# Altium schematic sheet power.SchDoc: Power
size A4; Organization: Altium Limited; Address1: L3, 12a Rodborough Rd; Address2: Frenchs Forest; Address3: NSW; Address4: Australia 2086; Revision: A; SheetNumber: 7; SheetTotal: 7
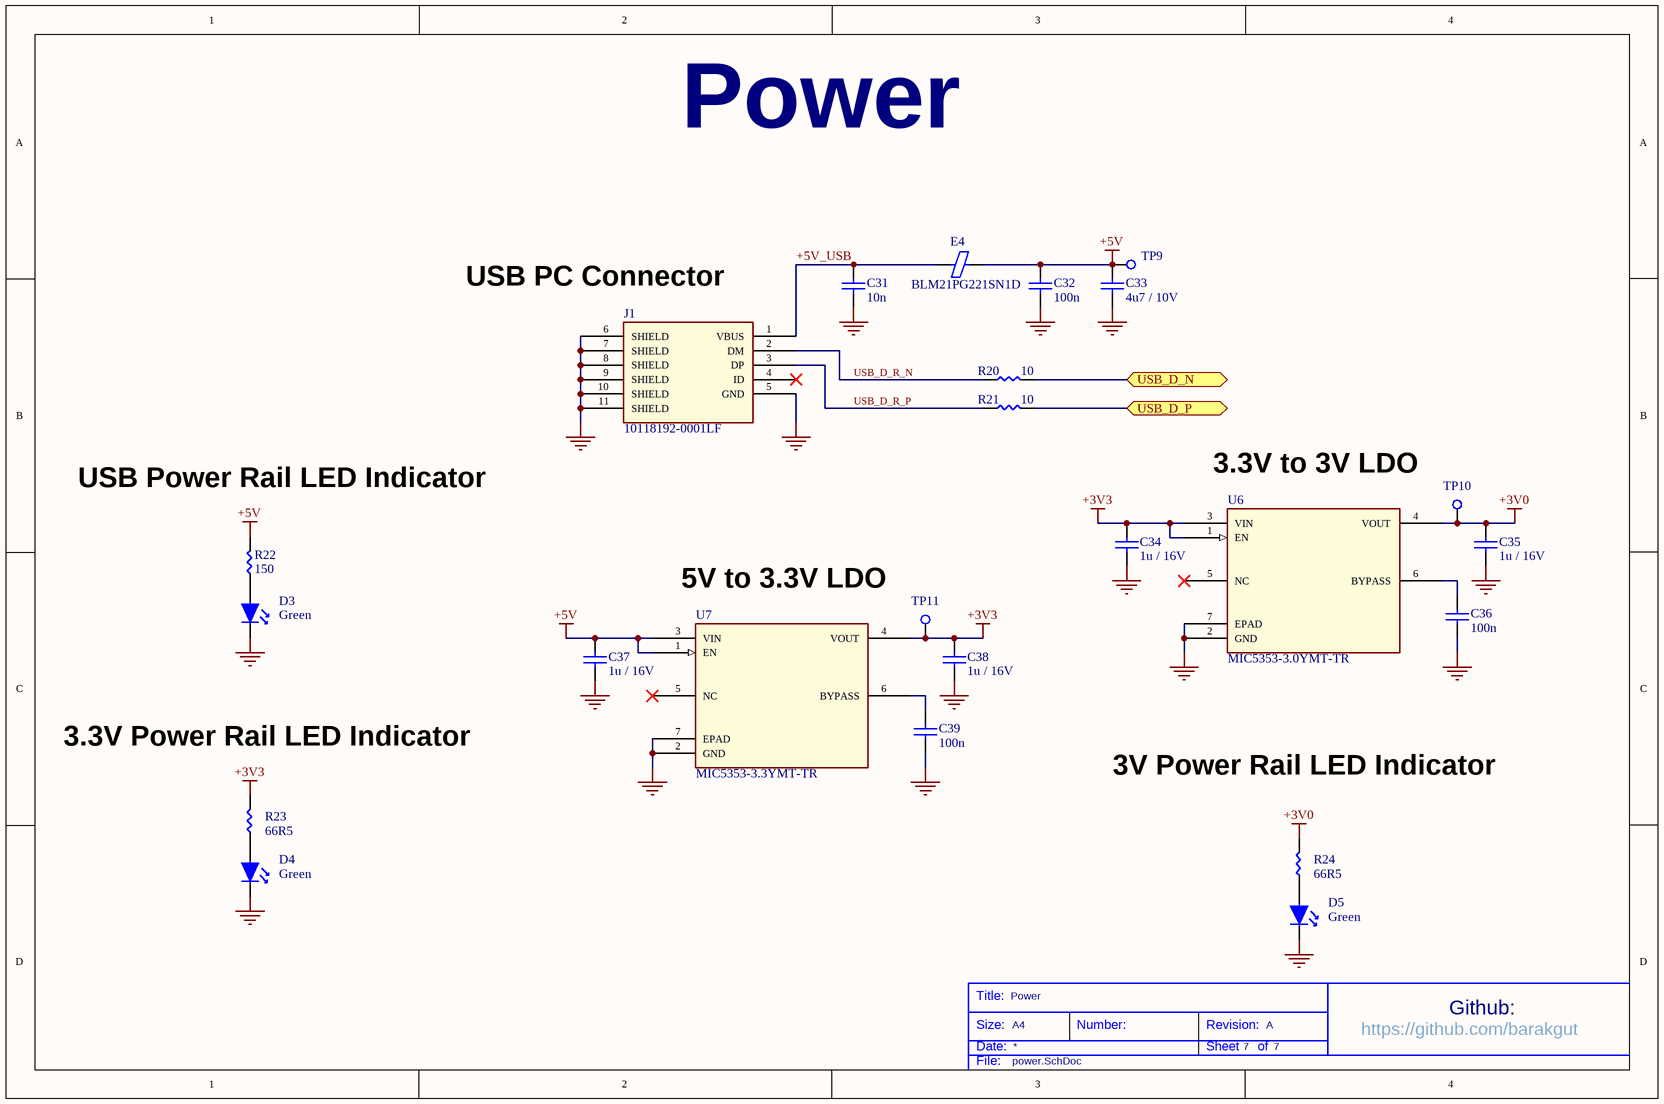
[diagram p0: power.SchDoc]

## Parts
C31  10n  [C0402]
C32  100n  [C0402]
C33  4u7 / 10V  [C0805]
C34  1u / 16V  [C0805]
C35  1u / 16V  [C0805]
C36  100n  [C0402]
C37  1u / 16V  [C0805]
C38  1u / 16V  [C0805]
C39  100n  [C0402]
D3  Green  [150141VS73100_LED]
D4  Green  [150141VS73100_LED]
D5  Green  [150141VS73100_LED]
E4  BLM21PG221SN1D  [R0805]
J1  10118192-0001LF  [10118192-0001LF]
R20  10  [R0402]
R21  10  [R0402]
R22  150  [R0805]
R23  66R5  [R0805]
R24  66R5  [R0805]
TP9  Test Pad 1mm  [TP_1MM]  (value not drawn)  (no BOM)
TP10  Test Pad 1mm  [TP_1MM]  (value not drawn)  (no BOM)
TP11  Test Pad 1mm  [TP_1MM]  (value not drawn)  (no BOM)
U6  MIC5353-3.0YMT-TR  [6-MLF]
U7  MIC5353-3.3YMT-TR  [6-MLF]

## Ports
USB_D_N (bidir), USB_D_P (bidir)

## Nets
+3V0: C35.2 R24.2 TP10.1 U6.4(VOUT)
+3V3: C34.2 C38.2 R23.2 TP11.1 U6.1(EN) U6.3(VIN) U7.4(VOUT)
+5V: C32.2 C33.2 C37.2 E4.2 R22.2 TP9.1 U7.1(EN) U7.3(VIN)
GND: C31.1 C32.1 C33.1 C34.1 C35.1 C36.1 C37.1 C38.1 C39.1 D3.1(K) D4.1(K) D5.1(K) J1.5(GND) J1.6(SHIELD) J1.7(SHIELD) J1.8(SHIELD) J1.9(SHIELD) J1.10(SHIELD) J1.11(SHIELD) U6.2(GND) U6.7(EPAD) U7.2(GND) U7.7(EPAD)
+5V_USB: C31.2 E4.1 J1.1(VBUS)
USB_D_N: R20.2 ; port USB_D_N
USB_D_P: R21.2 ; port USB_D_P
USB_D_R_N: J1.2(DM) R20.1
USB_D_R_P: J1.3(DP) R21.1
NetC36_2: C36.2 U6.6(BYPASS)
NetC39_2: C39.2 U7.6(BYPASS)
NetD3_2: D3.2(A) R22.1
NetD4_2: D4.2(A) R23.1
NetD5_2: D5.2(A) R24.1

Not connected (* = marked no-connect by the designer): J1 4(ID)*; U6 5(NC)*; U7 5(NC)*

## Notes on the sheet
- Power
- (near J1) USB PC Connector
- 3.3V to 3V LDO
- (near R22) USB Power Rail LED Indicator
- 5V to 3.3V LDO
- (near R23) 3.3V Power Rail LED Indicator
- 3V Power Rail LED Indicator
- Title:
- Size:
- Date:
- A4
- Number:
- Revision:
- Sheet
- of
- https://github.com/barakgut
- Github:
- File:

## Library data of the parts
C31 = CGA2B3X7R1V103K050BB: TDK         CGA2B3X7R1V103K050BB             SMD Multilayer Ceramic Capacitor, 0402 [1005 Metric], 0.01 F, 35 V,  10%, X7R, CGA Series; PCN Part Number: MLCC Part Number Change 30/Nov/2012; Product Training Modules: CGA Series for Automotive Applications SEAT, CCV, and TVCL Design Tools Guide to Replacing an Electrolytic Capacitor with an MLCC; Featured Product: CGA Series MLCC Capacitors; Capacitance: 10000pF; Voltage - Rated: 35V; Online Catalog: CGA Series, Automotive General, Mid and High Voltage; Other Names: 445-6900-6; Supplier 1: Digi-Key; Supplier Part Number 1: 445-6900-1-ND; Manufacturer: TDK; Stock 1: 100000; Pricing 1: 1=0.11, 10=0.083, 100=0.0372, 500=0.0265, 1000=0.0209, 2500=0.019, 5000=0.0174 (USD); Tolerance: ±10%; Operating Temperature: -55°C ~ 125°C; Category: Capacitors; RoHS Information: RoHS Certificate-MLCC; Standard Package: 1; Family: Ceramic Capacitors; Series: CGA; Packaging: Digi-Reel®; Temperature Coefficient: X7R; Mounting Type: Surface Mount, MLCC; Applications: Automotive; Ratings: AEC-Q200; Package / Case: 0402 (1005 Metric); Size / Dimension: 0.039" L x 0.020" W (1.00mm x 0.50mm); Height - Seated (Max): -; Thickness (Max): 0.022" (0.55mm); Lead Spacing: -; Features: -; Lead Style: -; ComponentLink1URL: http://www.farnell.com/datasheets/1807242.pdf; ComponentLink1Description: http://www.farnell.com/datasheets/1807242.pdf; ComponentLink2URL: http://www.mouser.com/ds/2/400/lcc_automotive_general_en-843974.pdf; ComponentLink2Description: http://www.mouser.com/ds/2/400/lcc_automotive_general_en-843974.pdf; Manufacturer Part Number: CGA2B3X7R1V103K050BB
C32 C36 C39 = CGA2B3X7R1E104K050BB: TDK         CGA2B3X7R1E104K050BB             SMD Multilayer Ceramic Capacitor, 0402 [1005 Metric], 0.1 F, 25 V,  10%, X7R, CGA Series; PCN Part Number: MLCC Part Number Change 30/Nov/2012; Capacitance: 0.1µF; Product Training Modules: CGA Series for Automotive Applications SEAT, CCV, and TVCL Design Tools Guide to Replacing an Electrolytic Capacitor with an MLCC; Featured Product: CGA Series MLCC Capacitors; Voltage - Rated: 25V; Online Catalog: CGA Series, Automotive General, Mid and High Voltage; Other Names: 445-6902-6; Supplier 1: Digi-Key; Supplier Part Number 1: 445-6902-1-ND; Manufacturer: TDK; Stock 1: 100000; Pricing 1: 1=0.16, 10=0.115, 100=0.054, 500=0.0379, 1000=0.0314, 2500=0.0292, 5000=0.0267 (USD); Package / Case: 0402 (1005 Metric); Packaging: Digi-Reel®; RoHS Information: RoHS Certificate-MLCC; Standard Package: 1; Category: Capacitors; Family: Ceramic Capacitors; Series: CGA; Tolerance: ±10%; Temperature Coefficient: X7R; Mounting Type: Surface Mount, MLCC; Operating Temperature: -55°C ~ 125°C; Applications: Automotive; Ratings: AEC-Q200; Size / Dimension: 0.039" L x 0.020" W (1.00mm x 0.50mm); Height - Seated (Max): -; Thickness (Max): 0.022" (0.55mm); Lead Spacing: -; Features: -; Lead Style: -; ComponentLink1URL: http://www.farnell.com/datasheets/1735392.pdf; ComponentLink1Description: http://www.farnell.com/datasheets/1735392.pdf; ComponentLink2URL: http://www.mouser.com/ds/2/400/lcc_automotive_general_en-843974.pdf; ComponentLink2Description: http://www.mouser.com/ds/2/400/lcc_automotive_general_en-843974.pdf; Manufacturer Part Number: CGA2B3X7R1E104K050BB
C33 = C2012X7R1A475K085AC: 4.7µF ±10% 10V X7R Ceramic Capacitor -55°C ~ 125°C Surface Mount, MLCC 0805 (2012 Metric) 0.079" L x 0.049" W (2.00mm x 1.25mm); Manufacturer: TDK; Product Training Modules: C Series General Applications SEAT, CCV, and TVCL Design Tools Guide to Replacing an Electrolytic Capacitor with an MLCC; EDA / CAD Models: Download from Accelerated Designs; Online Catalog: C Series, General Purpose; Other Names: 445-14527-6; Supplier 1: Digi-Key; Supplier Part Number 1: 445-14527-1-ND; Stock 1: 1; Pricing 1: 1=0.28, 10=0.19, 100=0.1075, 500=0.0759, 1000=0.0664 (USD); RoHS Information: RoHS Certificate-MLCC; Standard Package: 1; Category: Capacitors; Family: Ceramic Capacitors; Series: C; Packaging: Digi-Reel®; Capacitance: 4.7µF; Tolerance: ±10%; Voltage - Rated: 10V; Temperature Coefficient: X7R; Mounting Type: Surface Mount, MLCC; Operating Temperature: -55°C ~ 125°C; Applications: General Purpose; Package / Case: 0805 (2012 Metric); Size / Dimension: 0.079" L x 0.049" W (2.00mm x 1.25mm); Thickness (Max): 0.039" (1.00mm); Manufacturer Part Number: C2012X7R1A475K085AC
C34 C35 C37 C38 = C0805C105K4RAC7800: Multilayer Ceramic Capacitors MLCC - SMD/SMT 16volts 1uF X7R 10%; Manufacturer: KEMET; Rad Hard: No; Voltage: 16 Vdc; Product Length: 2 mm; Product Height: 0.9 mm; Product Depth: 1.25 mm; Supplier 1: Digi-Key; Supplier Part Number 1: 399-1284-1-ND; Stock 1: 40000; Pricing 1: 1=0.17, 10=0.124, 100=0.0581, 500=0.0408, 1000=0.0337 (USD); Package/Case: 0805; Mounting: Surface Mount; Capacitance Value: 1 uF; Tolerance: 10 %; Dielectric: X7R; Operating Temperature: -55 to 125 °C; Construction: Flat; Category: Capacitor Ceramic Multilayer; Manufacturer Part Number: C0805C105K4RAC7800
D3-D5 = 150141VS73100: WURTH ELEKTRONIK   150141VS73100   LED, GREEN, 90MCD, 570NM; Manufacturer: Wurth Electronics; Dynamic Catalog: 3.5mm x 2.8mm Round with Flat Top LEDs; 3D Model: SMTW_3528.igs / SMTW_3528.stp / SMTW_3528.wrl; Wavelength - Peak: 572nm; Voltage - Forward (Vf) (Typ): 2V; Current - Test: 20mA; Viewing Angle: 120°; Lens Type: Clear; Lens Style/Size: Round with Flat Top, 2.4mm; Other Names: 732-5002-1; Supplier 1: Digi-Key; Supplier Part Number 1: 732-5002-1-ND; Stock 1: 7722; Pricing 1: 1=0.17, 100=0.149, 500=0.113 (USD); Standard Package: 1; Category: Optoelectronics; Family: LED Indication - Discrete; Series: WL-SMTW; Packaging: Cut Tape (CT); Color: Green; Wavelength - Dominant: 570nm; Millicandela Rating: 90mcd; Package / Case: 2-PLCC; Size / Dimension: 3.20mm L x 2.80mm W; Height: 2.10mm; Mounting Type: Surface Mount; Online Catalog: 3.5mm x 2.8mm Round with Flat Top LEDs; Manufacturer Part Number: 150141VS73100
E4 = BLM21PG221SN1D: FERRITE CHIP 220 OHM 0805; Manufacturer: Murata; Product Training Modules: Ferrite Beads and Arrays; Catalog Drawings: BLM21 Series Side BLM21 Series Top; EDA / CAD Models: Download from Accelerated Designs; Filter Type: Power Line; Number of Lines: 1; Impedance @ Frequency: 220 Ohm @ 100MHz; Current Rating (Max): 2A; DC Resistance (DCR) (Max): 45 mOhm; Online Catalog: EMIFIL® BLM21P Series; Other Names: 490-1054-6; Supplier 1: Digi-Key; Supplier Part Number 1: 490-1054-1-ND; Stock 1: 1796179; Pricing 1: 1=0.1, 10=0.081, 25=0.0732, 50=0.0538, 100=0.0464, 250=0.0366, 500=0.0309, 1000=0.0261 (USD); Standard Package: 1; Category: Filters; Family: Ferrite Beads and Chips; Series: BLM21P; Packaging: Digi-Reel®; Ratings: -; Operating Temperature: -55°C ~ 125°C; Package / Case: 0805 (2012 Metric); Mounting Type: Surface Mount; Height (Max): 0.041" (1.05mm); Size / Dimension: 0.079" L x 0.049" W (2.00mm x 1.25mm); Manufacturer Part Number: BLM21PG221SN1D
J1 = 10118192-0001LF: USB - micro B USB 2.0 Receptacle Connector 5 Position Surface Mount, Right Angle, Horizontal; Manufacturer: Amphenol FCI; Number of Contacts: 5 Contact; Gender: Female; Current Rating: 1.8 A; Brand: FCI; Connector Type: Micro USB Type B receptacle; Insulation Resistance: 1000 MOhms; Supplier 1: Digi-Key; Supplier Part Number 1: 609-4613-1-ND; Stock 1: 158518; Pricing 1: 1=0.42, 10=0.393, 25=0.3536, 50=0.3144, 100=0.3013, 250=0.2751, 500=0.262 (USD); Product Category: USB Connectors; RoHS: Details; Product: Micro USB Type B Connectors; Standard: USB 2.0; Termination Style: SMD/SMT; Color: Black; Contact Material: Copper Alloy; Contact Plating: Gold; Flammability Rating: UL 94 V-0; Mounting Angle: Right; Operating Temperature Range: - 55 C to + 85 C; Packaging: Reel; Factory Pack Quantity: 1400; Manufacturer Part Number: 10118192-0001LF
R20 R21 = RC0402FR-0710RL: RES SMD 10 OHM 1% 1/16W 0402; Manufacturer: Yageo; Resistance: 10 Ohms; Power Rating: 62.5 mW (1/16 W); Temperature Coefficient: 100 PPM / C; Voltage Rating: 50 V; Supplier 1: Digi-Key; Supplier Part Number 1: 311-10.0LRCT-ND; Stock 1: 1306139; Pricing 1: 1=0.1, 10=0.027, 100=0.0111, 1000=0.005, 2500=0.0043, 5000=0.0036 (USD); Case Code - in: 0402; Case Code - mm: 1005; Operating Temperature Range: - 55 C to + 155 C; Packaging: Reel; Product: Thick Film Resistors General Purpose; Series: RC; Termination Style: SMD/SMT; Tolerance: 1 %; Manufacturer Part Number: RC0402FR-0710RL; ComponentLink1URL: http://www.farnell.com/datasheets/1018594.pdf; ComponentLink1Description: http://www.farnell.com/datasheets/1018594.pdf; ComponentLink2URL: https://www.verical.com/server-webapp/html/getDatasheet?partID=323697; ComponentLink2Description: https://www.verical.com/server-webapp/html/getDatasheet?partID=323697
R22 = AC0805FR-07150RL: Thick Film Resistors - SMD 1/8W 150ohm 1%; Manufacturer: Yageo; Case Height: 0.5 mm; Case Length: 2 mm; Case Width: 1.25 mm; Power Rating: 125 mW (1/8 W); Resistance: 150 Ohms; Temperature Coefficient: 100 PPM / C; Voltage Rating: 150 V; Supplier 1: Digi-Key; Supplier Part Number 1: YAG3694CT-ND; Stock 1: 32315; Pricing 1: 1=0.1, 10=0.055, 100=0.0225, 1000=0.0101, 2500=0.0088 (USD); Brand: Yageo; Case Code - in: 0805; Case Code - mm: 2012; Dimensions: 1.25 mm W x 2 mm L x 0.5 mm H; Product Category: Thick Film Resistors - SMD; Operating Temperature Range: - 55 C to + 155 C; Package / Case: 0805 (2012 metric); Packaging: Reel; Product: Thick Film Resistors SMD; Termination Style: SMD/SMT; RoHS: Details; Tolerance: 1 %; Series: AC; Type: Chip Resistor Surface Mount; Manufacturer Part Number: AC0805FR-07150RL
R23 R24 = RC0805FR-0766R5L: Thick Film Resistors - SMD 66.5 OHM 1%; Manufacturer: Yageo; Case Height: 0.5 mm; Case Length: 2 mm; Case Width: 1.25 mm; Power Rating: 125 mW (1/8 W); Resistance: 66.5 Ohms; Temperature Coefficient: 100 PPM / C; Voltage Rating: 150 V; Supplier 1: Digi-Key; Supplier Part Number 1: 311-66.5CRCT-ND; Stock 1: 162629; Pricing 1: 1=0.1, 10=0.056, 100=0.0228, 1000=0.0102, 2500=0.0089 (USD); Brand: Yageo; Case Code - in: 0805; Case Code - mm: 2012; Dimensions: 1.25 mm W x 2 mm L x 0.5 mm H; Product Category: Thick Film Resistors - SMD; Operating Temperature Range: - 55 C to + 155 C; Package / Case: 0805 (2012 metric); Packaging: Reel; Product: Thick Film Resistors General Purpose; Termination Style: SMD/SMT; RoHS: Details; Tolerance: 1 %; Series: RC; Type: General Purpose Chip Resistor Surface Mount; Manufacturer Part Number: RC0805FR-0766R5L
TP9-TP11 = TEST_PAD_1mm
U6 = MIC5353-3.0YMT-TR: 6Vin, Single 500mA ULDO, 6 UDFN 1.6x1.6x0.6mm T/R; Manufacturer: Microchip; Regulator Topology: Positive Fixed; Voltage - Output: 3V; Voltage - Dropout (Typical): 0.16V @ 500mA; Number of Regulators: 1; Voltage - Input: Up to 6V; Current - Limit (Min): 600mA; Supplier 1: Digi-Key; Supplier Part Number 1: 576-3679-1-ND; Stock 1: 4083; Pricing 1: 1=0.35, 25=0.2884, 100=0.2678 (USD); Category: Integrated Circuits (ICs); Family: PMIC - Voltage Regulators - Linear; Series: -; Packaging: Digi-Reel®; Current - Output: 500mA; Operating Temperature: -40°C ~ 125°C; Mounting Type: Surface Mount; Package / Case: 6-UFDFN Exposed Pad, 6-TMLF®; Supplier Device Package: 6-TMLF® (1.6x1.6); Manufacturer Part Number: MIC5353-3.0YMT-TR
U7 = MIC5353-3.3YMT-TR: MICROCHIP         MIC5353-3.3YMT-TR             Fixed LDO Voltage Regulator, 2.6V to 6V, 160mV Dropout, 3.3Vout, 500mAout, MLF-6; Fixed Output Voltage Nom.: 3.3V; Output Current: 500mA; LDO Regulator Case Style: MLF; No. of Pins: 6Pins; Product Range: 3.3V 500mA LDO Voltage Regulators; SVHC: No SVHC (17-Dec-2015); Supplier 1: Digi-Key; Supplier Part Number 1: 576-3680-1-ND; Manufacturer: Microchip; Stock 1: 12369; Pricing 1: 1=0.43, 25=0.35, 100=0.325 (USD); Output Type: Fixed; Input Voltage Min: 2.6V; Input Voltage Max: 6V; Adjustable Output Voltage Min: -; Adjustable Output Voltage Max: -; Dropout Voltage Vdo: 160mV; Operating Temperature Min: -40°C; Operating Temperature Max: 125°C; Packaging: Cut Tape; Automotive Qualification Standard: -; MSL: MSL 1 - Unlimited; Manufacturer Part Number: MIC5353-3.3YMT-TR